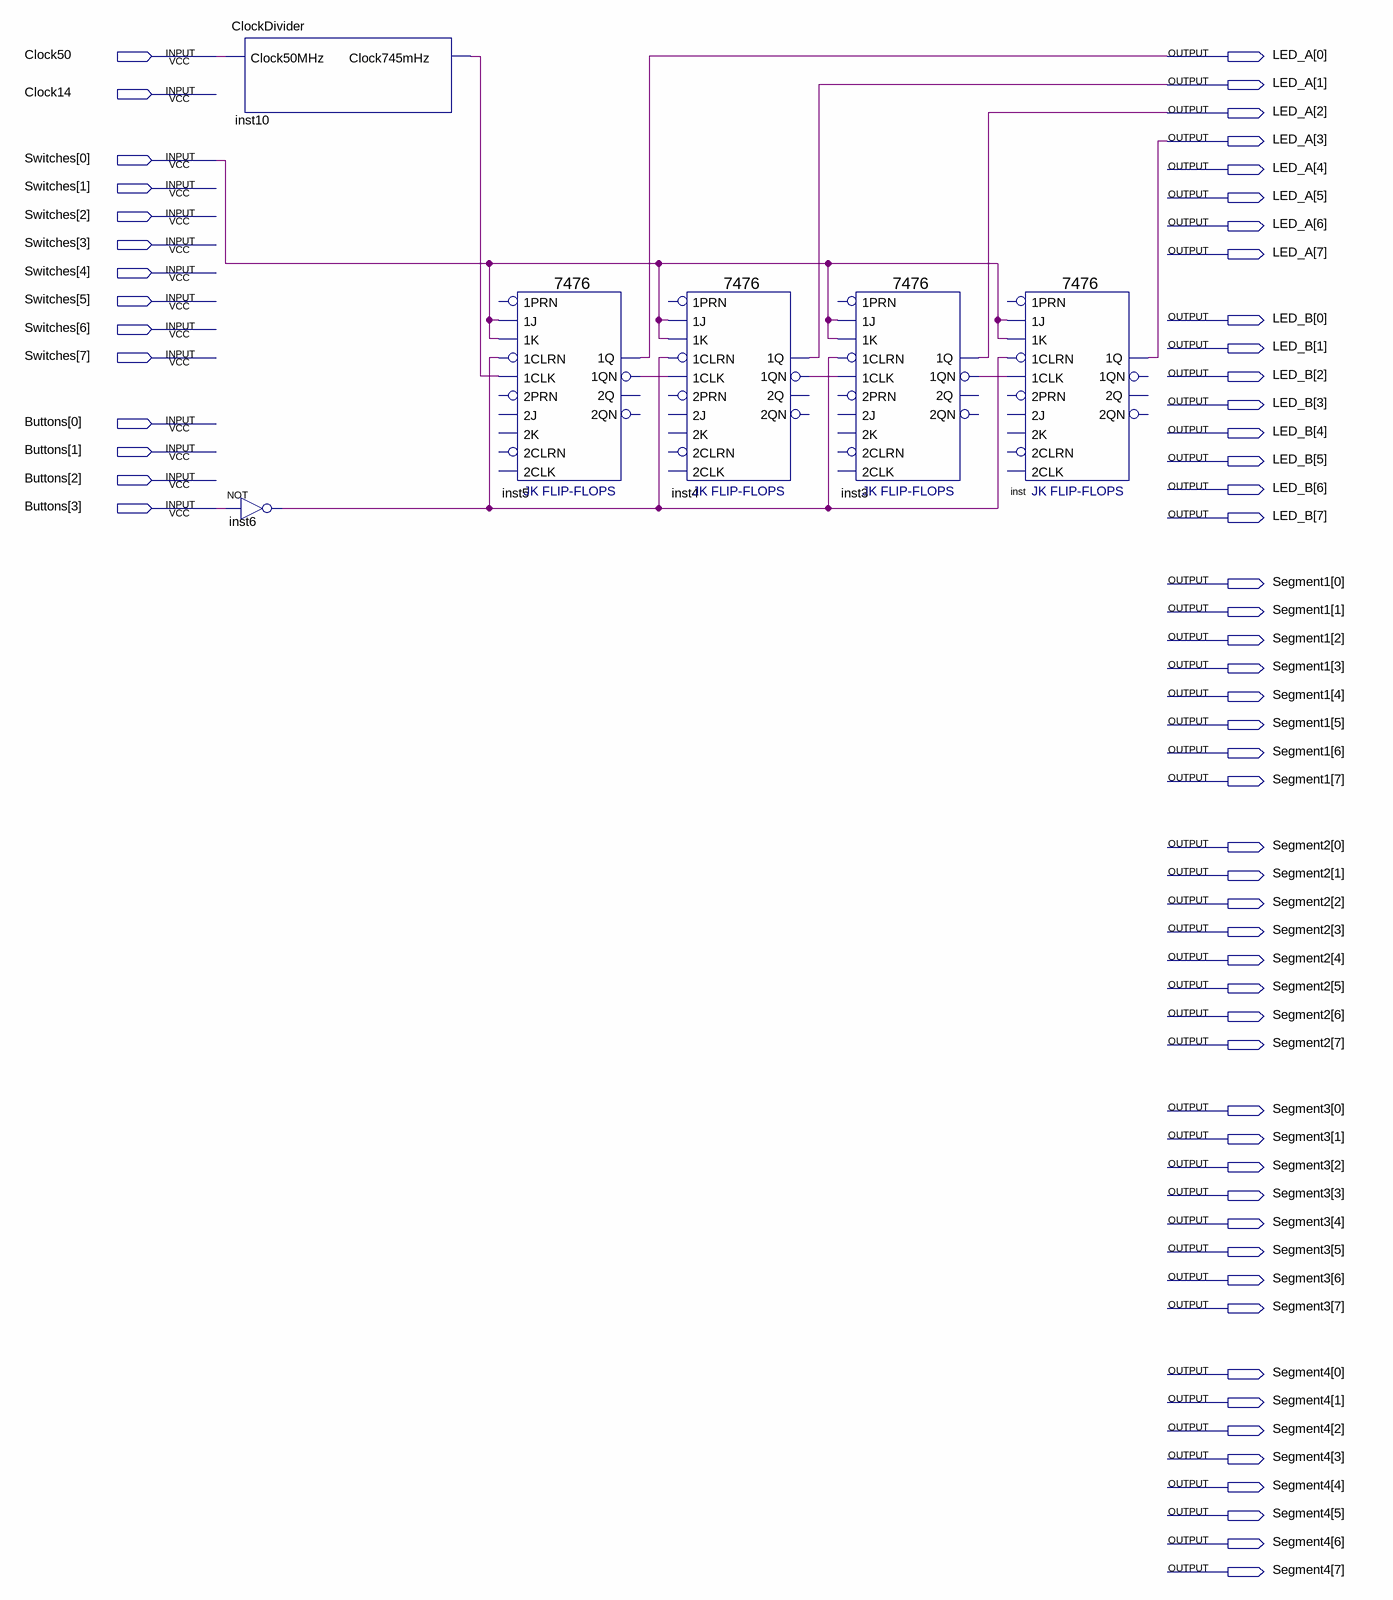
[diagram p0: schematic sheet]
// Quartus schematic Asynchronzaehler.bdf as structural Verilog: 6 symbols, 62 pins
module Asynchronzaehler (
  input  Clock50,
  input  Clock14,
  input  [7:0] Switches,
  input  [3:0] Buttons,
  output [7:0] LED_A,
  output [7:0] LED_B,
  output [7:0] Segment1,
  output [7:0] Segment2,
  output [7:0] Segment3,
  output [7:0] Segment4
);

  wire inst3_1qn, inst4_1qn, inst5_1qn, inst6_out, inst10_clock745mhz;

  ClockDivider inst10 (.Clock50MHz(Clock50), .Clock745mHz(inst10_clock745mhz));
  not inst6 (inst6_out, Buttons[3]);
  \7476  inst5 (
    .\1J (Switches[0]), .\1K (Switches[0]), .\1CLK (inst10_clock745mhz), .\1CLRN (inst6_out),
    .\1Q (LED_A[0]), .\1QN (inst5_1qn));  // open: 1PRN, 2PRN, 2J, 2K, 2CLRN, 2CLK, 2QN, 2Q
  \7476  inst4 (
    .\1J (Switches[0]), .\1K (Switches[0]), .\1CLK (inst5_1qn), .\1CLRN (inst6_out), .\1Q (LED_A[1]),
    .\1QN (inst4_1qn));  // open: 1PRN, 2PRN, 2J, 2K, 2CLRN, 2CLK, 2QN, 2Q
  \7476  inst3 (
    .\1J (Switches[0]), .\1K (Switches[0]), .\1CLK (inst4_1qn), .\1CLRN (inst6_out), .\1Q (LED_A[2]),
    .\1QN (inst3_1qn));  // open: 1PRN, 2PRN, 2J, 2K, 2CLRN, 2CLK, 2QN, 2Q
  \7476  inst (
    .\1J (Switches[0]), .\1K (Switches[0]), .\1CLK (inst3_1qn), .\1CLRN (inst6_out), .\1Q (LED_A[3]));  // open: 1PRN, 2PRN, 2J, 2K, 2CLRN, 2CLK, 2QN, 2Q, 1QN
endmodule
